# EAGLE design dome-board3 (EAGLE 5.09)
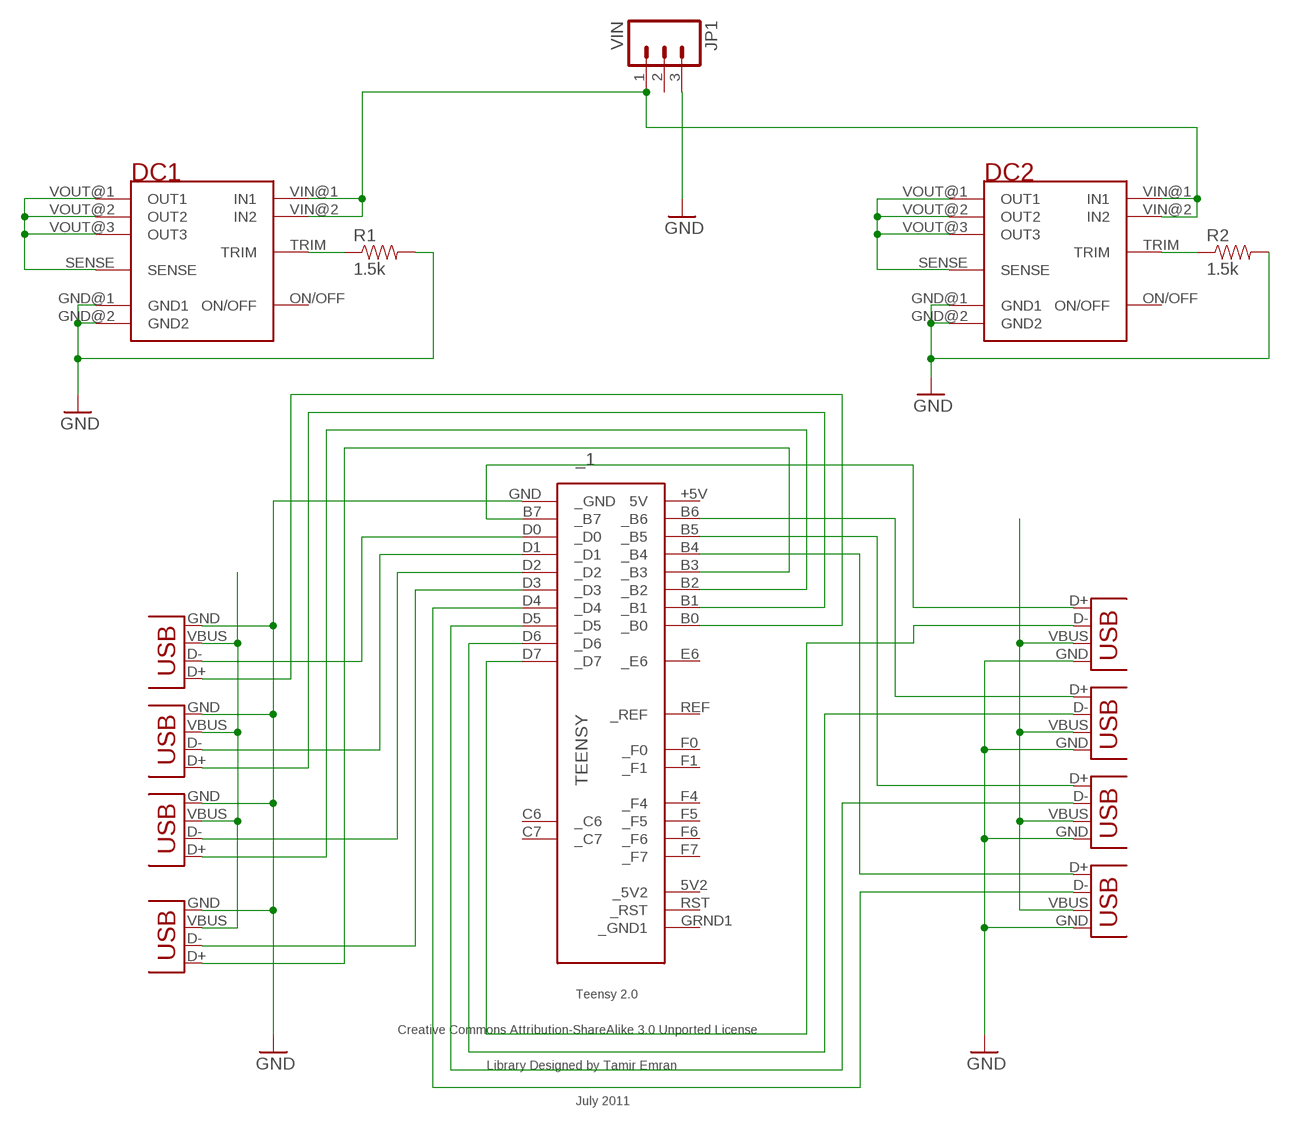
[diagram p0: schematic, sheet 1]

## Parts
_1  TEENSY  [TEENSY]
DC1  OKX2-T/16-D12P-C  [OKX2-T/16-D12P-C]
DC2  OKX2-T/16-D12P-C  [OKX2-T/16-D12P-C]
JP1  VIN  M03POLAR  [MOLEX-1X3]
R1  1.5k  RESISTORAXIAL-0.3  [AXIAL-0.3]
R2  1.5k  RESISTORAXIAL-0.3  [AXIAL-0.3]
USB1  USB  [USBA]
USB2  USB  [USBA]
USB3  USB  [USBA]
USB4  USB  [USBA]
USB5  USB  [USBA]
USB6  USB  [USBA]
USB7  USB  [USBA]
USB8  USB  [USBA]

## Nets
GND: _1.GND(_GND) DC1.GND@1(GND1) DC1.GND@2(GND2) DC2.GND@1(GND1) DC2.GND@2(GND2) JP1.3 R1.P$2 R2.P$2 USB1.GND USB2.GND USB3.GND USB4.GND USB5.GND USB6.GND USB7.GND USB8.GND
N$1: _1.B0(_B0) USB1.D+
N$2: _1.B1(_B1) USB2.D+
N$3: _1.B2(_B2) USB3.D+
N$4: _1.B3(_B3) USB4.D+
N$5: _1.B4(_B4) USB5.D+
N$6: _1.B5(_B5) USB6.D+
N$7: _1.B6(_B6) USB7.D+
N$9: _1.D0(_D0) USB1.D-
N$10: _1.D1(_D1) USB2.D-
N$11: _1.D2(_D2) USB3.D-
N$12: _1.D3(_D3) USB4.D-
N$13: _1.D4(_D4) USB5.D-
N$14: _1.D5(_D5) USB6.D-
N$15: _1.D6(_D6) USB7.D-
N$16: _1.D7(_D7) USB8.D-
N$17: DC1.TRIM R1.P$1
N$19: DC2.TRIM R2.P$1
N$20: _1.B7(_B7) USB8.D+
VCC1: DC1.SENSE DC1.VOUT@1(OUT1) DC1.VOUT@2(OUT2) DC1.VOUT@3(OUT3) USB1.VBUS USB2.VBUS USB3.VBUS USB4.VBUS
VCC2: DC2.SENSE DC2.VOUT@1(OUT1) DC2.VOUT@2(OUT2) DC2.VOUT@3(OUT3) USB5.VBUS USB6.VBUS USB7.VBUS USB8.VBUS
VIN: DC1.VIN@1(IN1) DC1.VIN@2(IN2) DC2.VIN@1(IN1) DC2.VIN@2(IN2) JP1.1
Unconnected: _1.5V2(_5V2) _1.+5V(5V) _1.C6(_C6) _1.C7(_C7) _1.E6(_E6) _1.F0(_F0) _1.F1(_F1) _1.F4(_F4) _1.F5(_F5) _1.F6(_F6) _1.F7(_F7) _1.GRND1(_GND1) _1.REF(_REF) _1.RST(_RST) DC1.ON/OFF DC2.ON/OFF JP1.2

## Library data of the parts
_1 = teensy:TEENSY: Teensy 2.0 Original Design by Clint Fisher Modified Design by Tamir Emran Licensed Under Creative Commons Attribution-ShareAlike 3.0 Unported (CC BY-SA 3.0)
DC1 DC2 = MaxHenstell:OKX2-T/16-D12P-C
JP1 = SparkFun:M03: Header 3 Standard 3-pin 0.1" header. Use with straight break away headers (SKU : PRT-00116), right angle break away headers (PRT-00553), swiss pins (PRT-00743), machine pins (PRT-00117), and female headers (PRT-00115). Molex polarized connector foot print use with SKU : PRT-08232 with associated crimp pins and housings.
R1 R2 = SparkFun:RESISTOR: Resistor Basic schematic elements and footprints for 0603, 1206, and PTH resistors.
USB1-USB8 = MaxHenstell:USB

## Net classes
0 default: width 0.305 mm, clearance 0.305 mm
1 power: width 3.124 mm, clearance 0.635 mm

## Board
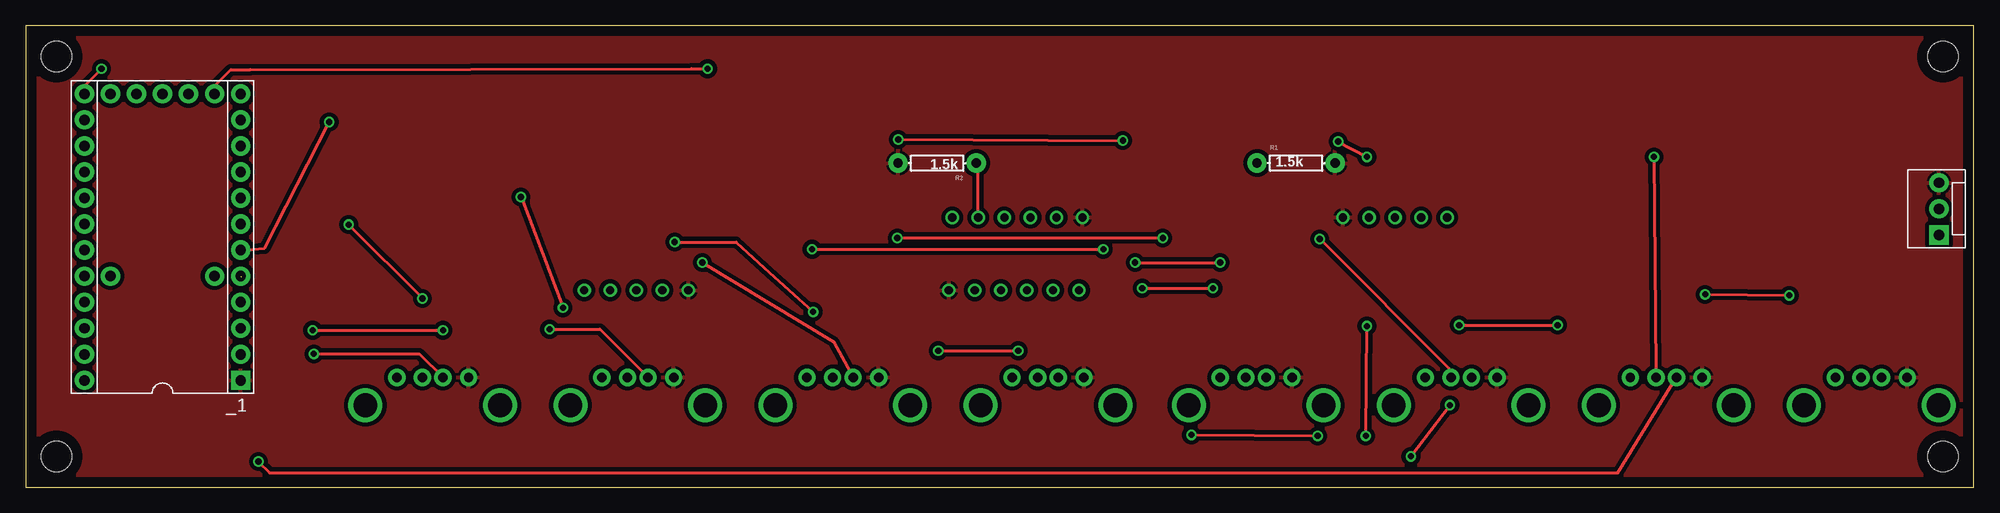
[diagram p1: board, top side]
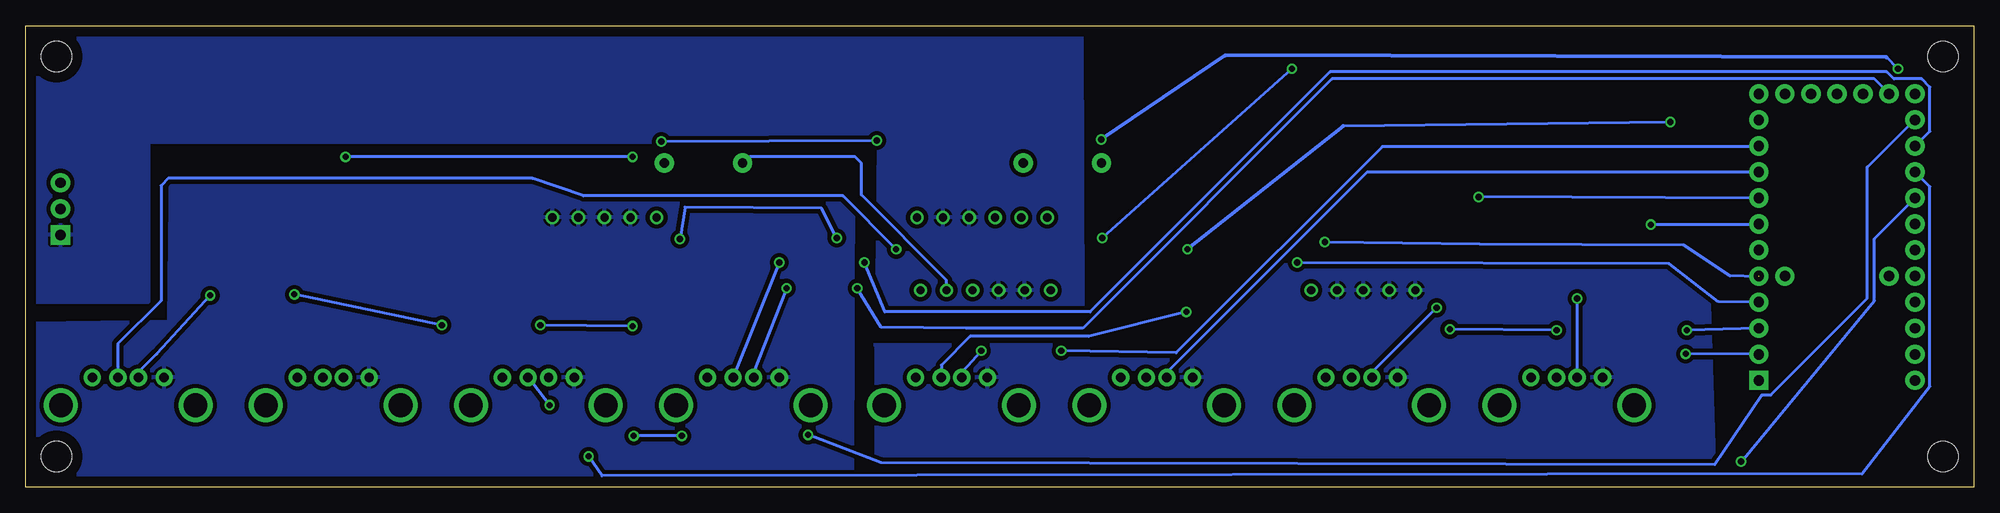
[diagram p2: board, bottom side, seen from below]

Size 190 x 45 mm. Coordinates in mm from the lower left corner, seen from the top.
Outline: 0,0 190,0 190,45 0,45 0,0
Copper layers (1*16): Top 0.035mm / dielectric 1.5mm / Bottom 0.035mm
Design rules "default": minimum track width 10mil, minimum drill 24mil, track to track 8mil, track to pad 8mil, pad to pad 8mil, via to via 8mil, smd to smd 8mil, copper to edge 40mil, drill to drill 8mil, minimum pad ring 10mil, minimum via ring 8mil, stop-mask expansion 4mil, vias tented up to drill 0mil, thermal gap 10mil
Holes 3 mm at 3,3 3,42 187,3 187,42

### Footprints (pad centres in the part's own frame; a part is rotated, then mirrored left to right if it is on the bottom)
TEENSY = drill 1.016 pad 1.88 round: 5V2 13.97,-2.54; +5V -13.97,7.62; B0 -11.43,-7.62; B1 -8.89,-7.62; B2 -6.35,-7.62; B3 -3.81,-7.62; B4 8.89,7.62; B5 6.35,7.62; B6 3.81,7.62; B7 -1.27,-7.62; C6 11.43,-7.62; C7 13.97,-7.62; D0 1.27,-7.62; D1 3.81,-7.62; D2 6.35,-7.62; D3 8.89,-7.62; D4 13.97,5.08; D5 13.97,-5.08; D6 13.97,7.62; D7 11.43,7.62; E6 -3.81,-5.08; F0 -11.43,7.62; F1 -8.89,7.62; F4 -6.35,7.62; F5 -3.81,7.62; F6 -1.27,7.62; F7 1.27,7.62; GRND1 13.97,0; REF -3.81,5.08; RST 13.97,2.54 | drill 1.016 pad 1.88 square: GND -13.97,-7.62
OKX2-T/16-D12P-C = drill 0.8 round: GND@1 13.97,0; GND@2 -11.43,0; NC -19.05,0; ON/OFF -24.13,0; SENSE 19.05,0; TRIM -21.59,0; VIN@1 -13.97,0; VIN@2 -16.51,0; VOUT@1 24.13,0; VOUT@2 21.59,0; VOUT@3 16.51,0
MOLEX-1X3 = drill 1.016 pad 1.88 square: 1 0,0 | drill 1.016 pad 1.88 round: 2 2.54,0; 3 5.08,0
AXIAL-0.3 = drill 0.9 pad 1.88 round: P$1 -3.81,0; P$2 3.81,0
USBA = drill 0.92 pad 1.676 round: D+ 0,-1; D- 0,1; GND 0,-3.5; VBUS 0,3.5 | drill 2.3 round: GND2 -2.71,-6.57; GND3 -2.71,6.57

### Placement (x,y rotation side)
_1  13.35,24.39 90 top
DC1  78.6,19.2 180 top
DC2  114.5,26.3 0 top
JP1  186.6,24.6 90 top
R1  123.9,31.6 0 top
R2  88.9,31.6 180 top
USB1  39.7,10.7 90 top
USB2  59.7,10.7 90 top
USB3  79.7,10.7 90 top
USB4  99.7,10.7 90 top
USB5  120,10.7 90 top
USB6  140,10.7 90 top
USB7  160,10.7 90 top
USB8  180,10.7 90 top

### Tracks (layer width: path | path; a pad name or v marks a point on that pad's centre or on a via)
GND
  pour Top (isolate 0.406): 0.7,44.6 189.3,44.3 189.7,0.3 0.4,0.4 0.7,44.5
N$1  (via drill 0.6)
  Top 0.305: USB1.D+ 38.4,13 v28.1,13
  Bottom 0.305: _1.B0 v28.1,13
N$2  (via drill 0.6)
  Top 0.305: USB2.D+ 56,15.4 v51.1,15.4 | v28,15.3 v40.7,15.3
  Bottom 0.305: _1.B1 v28,15.3 | v40.7,15.3 v51.1,15.4
N$3  (via drill 0.6)
  Top 0.305: v66,21.9 78.8,14.2 USB3.D+
  Bottom 0.305: v66,21.9 29.7,21.8 24.9,18.1 _1.B2
N$4  (via drill 0.6, 0.61)  (1 unrouted)
  Top 0.305: v76.8,17.1 72,21.4 69.3,23.9 v63.3,23.9
  Bottom 0.305: USB4.D+ 100.7,11.9 97.9,14.7 86.3,14.7 v76.8,17.1 | v63.3,23.9 48.2,23.7 28.3,23.6 23.8,20.6 21,20.5
N$5  (via drill 0.6)
  Top 0.305: v108.2,21.9 v116.5,21.9
  Bottom 0.305: v116.5,21.9 USB5.D+ | _1.B4 5.7,33.3 4.3,34.7 4.3,39 5.1,39.8 7.8,39.8 8.5,40.5 62.8,40.5 86.2,17.1 106.2,17.1 v108.2,21.9
N$6  (via drill 0.6)
  Top 0.305: v135.1,3 v138.9,8
  Bottom 0.305: _1.B5 5.7,30.7 4.3,29.3 4.3,9.8 10.9,1.3 133.8,1.1 v135.1,3 | v138.9,8 USB6.D+
N$7  (via drill 0.6)
  Top 0.305: USB7.D+ 155.3,1.4 23.8,1.4 v22.7,2.5
  Bottom 0.305: _1.B6 5.8,28.1 9.7,24.2 9.7,18.2 v22.7,2.5
N$9  (via drill 0.6)
  Top 0.305: v31.5,25.6 v38.7,18.4
  Bottom 0.305: _1.D0 21,25.6 v31.5,25.6 | v38.7,18.4 USB1.D-
N$10  (via drill 0.6)
  Top 0.305: v48.3,28.3 v52.4,17.5
  Bottom 0.305: USB2.D- 58.7,11.2 v52.4,17.5 | 21,28.1 _1.D1 v48.3,28.3
N$11
  Bottom 0.305: USB3.D- 78.7,11.2 59.2,30.7 21,30.7 _1.D2
N$12  (via drill 0.6)
  Top 0.305: v89,13.3 v96.8,13.3
  Bottom 0.305: USB4.D- 98.7,11.2 v96.8,13.3 | _1.D3 21,33.2 57.7,33.2 77.8,13.1 v89,13.3
N$13  (via drill 0.6)
  Top 0.305: v108.9,19.4 v115.8,19.4
  Bottom 0.305: USB5.D- 119,11.2 v115.8,19.4 | _1.D4 8.3,38.4 9.7,39.8 62.6,39.8 86.9,15.5 98.3,15.5 106.6,15.6 v108.9,19.4
N$14  (via drill 0.6)
  Top 0.305: USB6.D- 139,11.4 v126.2,24.2 | _1.D5 18.5,38.4 18.5,39.2 20,40.7 21.9,40.7 64.9,40.8 v66.5,40.8 | v85,24.3 v110.9,24.3
  Bottom 0.305: v66.5,40.8 v85,24.3 | v110.9,24.3 112.4,27.2 125.7,27.3 v126.2,24.2
N$15  (via drill 0.6, 0.61)
  Top 0.305: USB7.D- 159,11.4 v158.8,32.2 | v7.4,40.8 5.8,39.2 5.8,38.4 _1.D6 | v128,33.7 v130.8,32.2 | v85.1,33.9 v107,33.8
  Bottom 0.305: v130.8,32.2 v158.8,32.2 | v7.4,40.8 8.5,41.9 | v107,33.8 v128,33.7
  Bottom 0.406: v85.1,33.9 73,42.1 8.5,41.9
N$16  (via drill 0.6)
  Top 0.305: v113.7,5.1 v126,5 | v163.8,18.8 v172,18.7 | v139.8,15.8 v149.4,15.8 | v130.7,5 v130.8,15.7
  Bottom 0.305: USB8.D- 179,11.2 177.2,13 v172,18.7 | _1.D7 5.8,35.8 10.4,31.2 10.4,18.4 19.8,9 20.7,9 25.3,2.2 106.6,2.4 v113.7,5.1 | v149.4,15.8 v163.8,18.8 | v130.8,15.7 v139.8,15.8 | v126,5 v130.7,5
N$17
  Bottom 0.305: DC1.TRIM 100.2,20.2 108.5,28.5 108.5,31.6 109.1,32.2 119.4,32.2 120,31.6 R1.P$1
N$19
  Top 0.305: DC2.TRIM 92.9,31.5 92.8,31.6 R2.P$1
N$20  (via drill 0.6)
  Top 0.305: 21,23.2 _1.B7 23.3,23.3 v29.6,35.6 | v76.7,23.2 v105.1,23.2
  Bottom 0.305: USB8.D+ 181,14 176.8,18.2 176.8,29.4 176.1,30.1 140.6,30.1 135.6,28.4 110.3,28.4 v105.1,23.2 | v29.6,35.6 61.5,35.2
  Bottom 0.406: 61.5,35.2 v76.7,23.2
VCC1
  pour Bottom (isolate 0.406): 107.2,13.9 86.7,13.9 84.3,14.1 83.6,44.2 26.7,44.1 25.3,0.9 107,0.9 107,13.8
VCC2
  pour Bottom (isolate 0.406): 189.4,16 176,16.2 175.8,31.7 109.3,31.3 109.4,0.9 189.4,0.9 189.3,16
VIN
  pour Bottom (isolate 0.406): 86.9,16.7 87,44.8 189.9,44.8 189.9,18.1 178,18.1 178,33.7 106.8,33.7 107,15.5 86.7,15.5